# EasyEDA Pro project Prisme - Nov 2025.eprj

# Schematic Bottom Board
Board Name: Bottom Bottom; Create Date: 2025-11-04; Page Name: P1; Project Name: Prisme - Nov 2025; Schematic Name: Bottom Board; Update Date: 2025-11-09; Company: EasyEDA.com; Page Size: A4; Version: V1.0
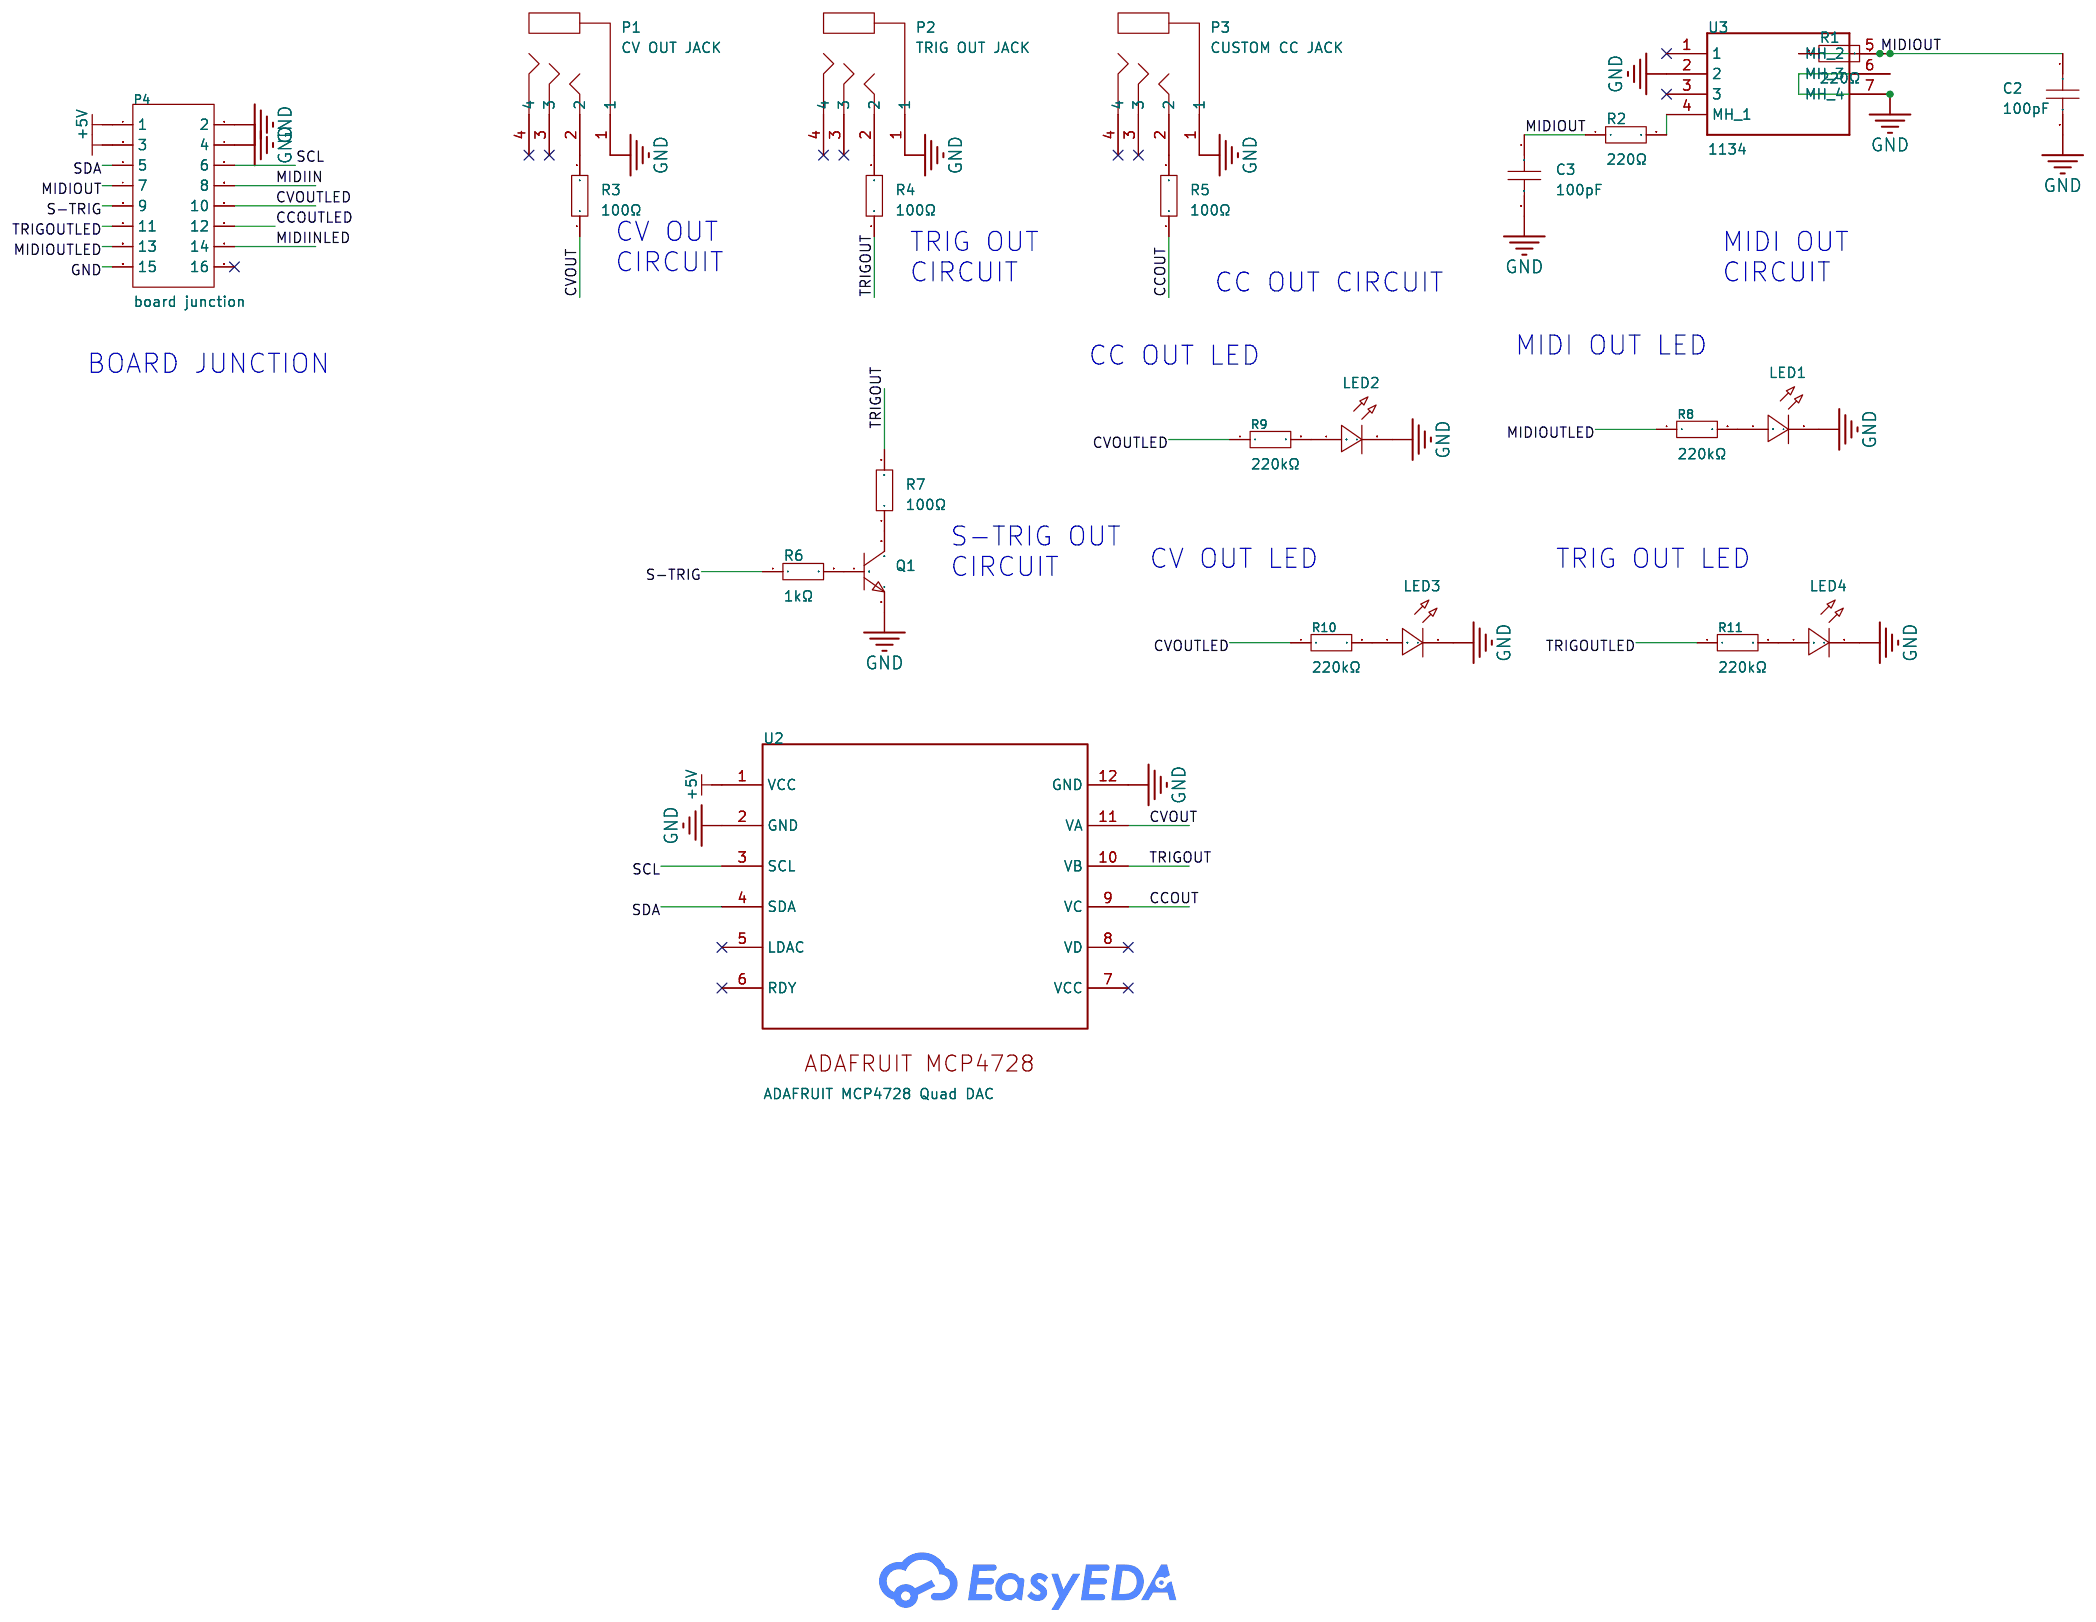
[diagram p0: schematic sheet]

## Parts
C2  100pF  [C0201]
C3  100pF  [C0201]
LED1  CVINLED  [LED-TH_BD3.0-P2.54-FD]
LED2  CVINLED  [LED-TH_BD3.0-P2.54-FD]
LED3  CVINLED  [LED-TH_BD3.0-P2.54-FD]
LED4  CVINLED  [LED-TH_BD3.0-P2.54-FD]
P1  CV OUT JACK  [AUDIO-TH_PJ-320A]
P2  TRIG OUT JACK  [AUDIO-TH_PJ-320A]
P3  CUSTOM CC JACK  [AUDIO-TH_PJ-320A]
P4  board junction  [IDC-TH_16P-P2.54_C3406]
Q1  -  [SOT-23_L2.9-W1.3-P1.90-LS2.4-BR]
R1  220Ω  [R0603]
R2  220Ω  [R0603]
R3  100Ω  [R0603]
R4  100Ω  [R0603]
R5  100Ω  [R0603]
R6  1kΩ  [R0603]
R7  100Ω  [R0603]
R8  220kΩ  [R0603]
R9  220kΩ  [R0603]
R10  220kΩ  [R0603]
R11  220kΩ  [R0603]
U2  ADAFRUIT MCP4728 Quad DAC
U3  1134  [1134]

## Library data of the parts
C2 C3 = CAP_0201: Supplier Footprint: 0201
LED1-LED4 = LED_TH-R_3mm: Supplier Footprint: Through
P1-P3 = PJ-320A: Supplier Part: C12569; Supplier Footprint: 插件; JLCPCB Part Class: Extended Part; Supplier: LCSC
P4 = 2.54-2*8P简牛: LCSC Part Name: 2.54mm 2x8P 排数:2 每排P数:8; Supplier Part: C3406; Manufacturer: BOOMELE(博穆精密); Supplier Footprint: 插件,P=2.54mm; JLCPCB Part Class: Extended Part; Datasheet: https://item.szlcsc.com/datasheet/2.54-2*8P%25E7%25AE%2580%25E7%2589%259B/3807.html; Supplier: LCSC; Connector Type: IDC Header; Pitch: 2.54mm; Number of Positions or Pins: 2x8P; Holder Type: Through Hole; Row Spacing: 2.54mm; Number of Rows: 2; Number of PINs Per Row: 8
Q1 = S8050_NPN: Supplier Footprint: SOT-23
R1-R7 = Res_0603: Supplier Footprint: 0603
R8-R11 = 0603WAF2203T5E: LCSC Part Name: 220kΩ ±1% 100mW 厚膜电阻; Supplier Part: C22961; Manufacturer: UNI-ROYAL(厚声); Supplier Footprint: 0603; JLCPCB Part Class: Basic Part; Datasheet: https://item.szlcsc.com/datasheet/0603WAF2203T5E/23688.html; Supplier: LCSC; Type: Thick Film Resistor; Tolerance: ±1%; Power(Watts): 100mW; Voltage-Supply(Max): 75V; Temperature Coefficient: ±100ppm/℃; Operating Temperature: -55℃~+155℃
U2 = ADAFRUIT MCP4728 Quad DAC: Manufacturer: ADAFRUIT; Manufacturer Part: MCP4728
U3 = 1134

## Nets
+3.3V: P4.3
+5V: P4.1 U2.1(VCC)
GND: C2.2 C3.2 LED1.2(A) LED2.2(A) LED3.2(A) LED4.2(A) P1.1 P2.1 P3.1 P4.2 P4.4 P4.15 Q1.2(E) U2.2(GND) U2.12(GND) U3.2 U3.6(MH_3) U3.7(MH_4)
CCOUT: R5.1 U2.9(VC)
CCOUTLED: P4.12
CVOUT: R3.1 U2.11(VA)
CVOUTLED: P4.10 R9.1 R10.1
MIDIIN: P4.8
MIDIINLED: P4.14
MIDIOUT: C2.1 C3.1 P4.7 R1.1 R1.2 R2.1 U3.5(MH_2)
MIDIOUTLED: P4.13 R8.1
S-TRIG: P4.9 R6.1
SCL: P4.6 U2.3(SCL)
SDA: P4.5 U2.4(SDA)
TRIGOUT: R4.1 R7.2 U2.10(VB)
TRIGOUTLED: P4.11 R11.1
Net-(LED1-1): LED1.1(C) R8.2
Net-(LED2-1): LED2.1(C) R9.2
Net-(LED3-1): LED3.1(C) R10.2
Net-(LED4-1): LED4.1(C) R11.2
Net-(P1-2): P1.2 R3.2
Net-(P2-2): P2.2 R4.2
Net-(P3-2): P3.2 R5.2
Net-(Q1-1): Q1.1(B) R6.2
Net-(Q1-3): Q1.3(C) R7.1
Net-(R2-2): R2.2 U3.4(MH_1)

Not connected (* = marked no-connect by the designer): P1 3* 4*; P2 3* 4*; P3 3* 4*; P4 16*; U2 5(LDAC)* 6(RDY)* 7(VCC)* 8(VD)*; U3 1* 3*

## Notes on the sheet
- CV OUT
  CIRCUIT
- TRIG OUT
  CIRCUIT
- MIDI OUT
  CIRCUIT
- CC OUT CIRCUIT
- MIDI OUT LED
- BOARD JUNCTION
- CC OUT LED
- CV OUT LED
- TRIG OUT LED
- S-TRIG OUT
  CIRCUIT

# Schematic Top Board
Board Name: Top Board; Create Date: 2025-11-04; Page Name: P1; Project Name: Prisme - Nov 2025; Schematic Name: Top Board; Update Date: 2025-11-04; Company: EasyEDA.com; Page Size: A4; Version: V1.0
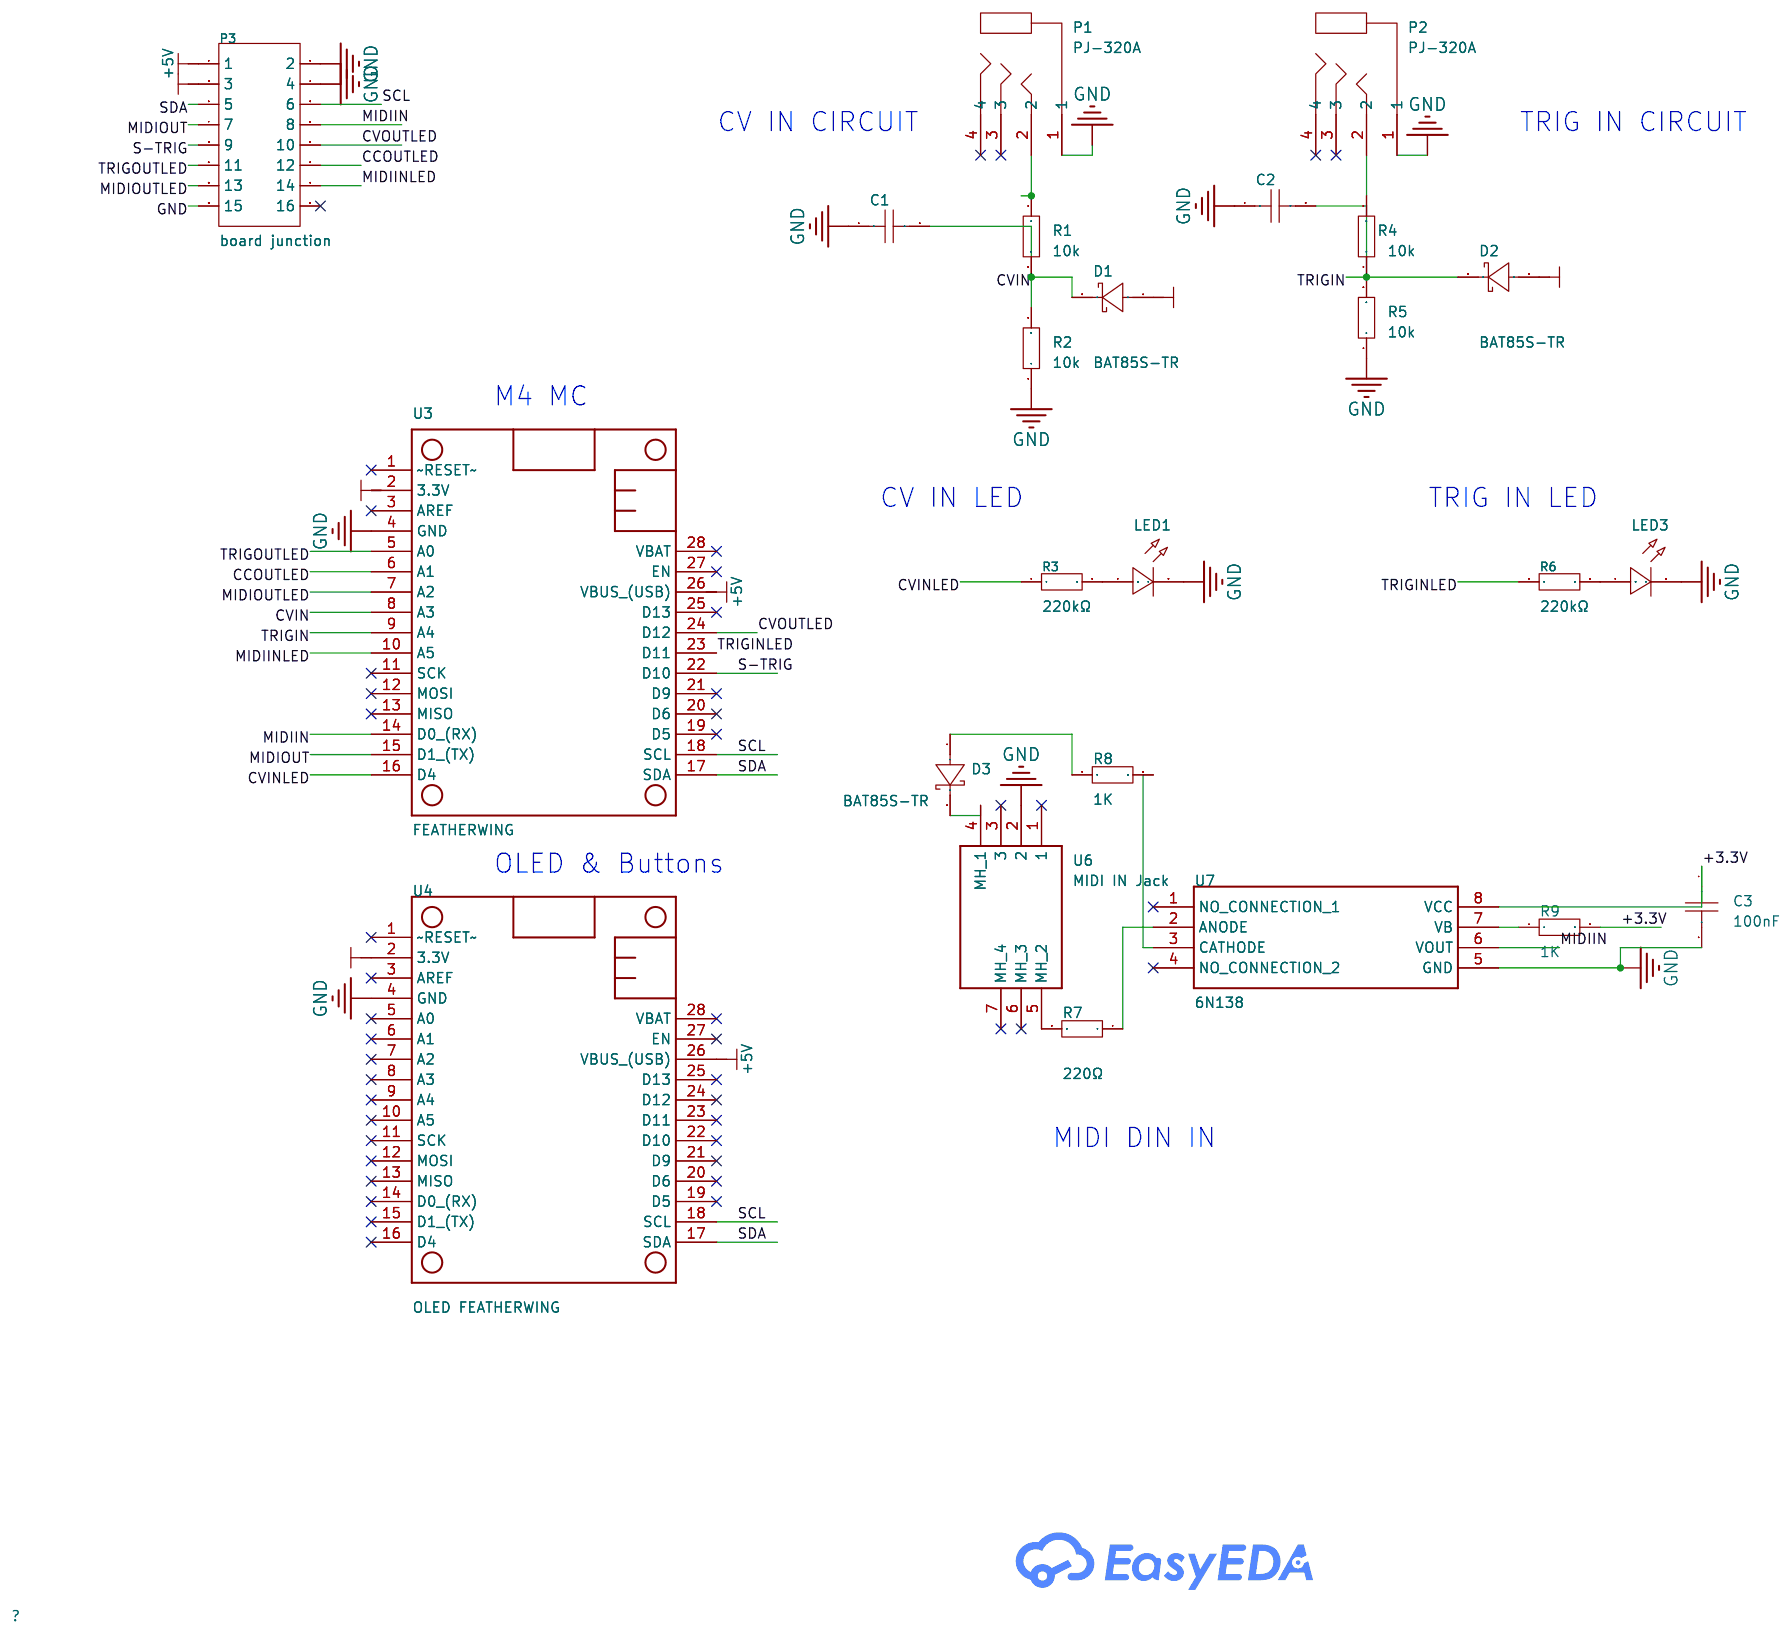
[diagram p1: schematic sheet]

## Parts
C1  100nF  [C0603]
C2  100nF  [C0603]
C3  100nF  [C0201]
D1  BAT85S-TR  [DO-35_BD1.7-L3.8-P7.8-D0.5-FD]
D2  BAT85S-TR  [DO-35_BD1.7-L3.8-P7.8-D0.5-FD]
D3  BAT85S-TR  [DO-35_BD1.7-L3.8-P7.8-D0.5-FD]
LED1  CVINLED  [LED-TH_BD3.0-P2.54-FD]
LED3  TRIGINLED  [LED-TH_BD3.0-P2.54-FD]
P1  PJ-320A  [AUDIO-TH_PJ-320A]
P2  PJ-320A  [AUDIO-TH_PJ-320A]
P3  board junction  [IDC-TH_16P-P2.54_C3406]
R1  10K  [R0603]
R2  10K  [R0603]
R3  220kΩ  [R0603]
R4  10K  [R0603]
R5  10K  [R0603]
R6  220kΩ  [R0603]
R7  220Ω  [R0603]
R8  1K  [R0603]
R9  1K  [R0603]
U3  FEATHERWING  [FEATHERWING]
U4  OLED FEATHERWING  [FEATHERWING]
U6  MIDI IN Jack  [1134]
U7  6N138  [DIP762W60P254L976H480Q8N]

## Library data of the parts
C1 C2 = CC0603KRX7R9BB104: LCSC Part Name: 100nF ±10% 50V; Supplier Part: C14663; Manufacturer: YAGEO(国巨); Supplier Footprint: 0603; JLCPCB Part Class: Basic Part; Datasheet: https://item.szlcsc.com/datasheet/CC0603KRX7R9BB104/15331.html; Supplier: LCSC; Tolerance: ±10%; Voltage Rating: 50V; Temperature Coefficient: X7R
C3 = CAP_0201: Supplier Footprint: 0201
D1-D3 = BAT85S-TR: Supplier Part: C5334431; Manufacturer: VISHAY(威世); Supplier Footprint: DO-35; JLCPCB Part Class: Extended Part; Datasheet: https://item.szlcsc.com/datasheet/BAT85S-TR/6098608.html; Supplier: LCSC; Diode Configuration: 1 Independent; Voltage - Forward(Vf@If): 800mV@100mA; Voltage - DC Reverse(Vr): 30V; Current - Rectified: 200mA; Reverse Leakage Current (Ir): 2uA@25V; Non-Repetitive Peak Forward Surge Current: 5A
LED1 LED3 = LED_TH-R_3mm: Supplier Footprint: Through
P1 P2 = PJ-320A: Supplier Part: C12569; Supplier Footprint: 插件; JLCPCB Part Class: Extended Part; Supplier: LCSC
P3 = 2.54-2*8P简牛: LCSC Part Name: 2.54mm 2x8P 排数:2 每排P数:8; Supplier Part: C3406; Manufacturer: BOOMELE(博穆精密); Supplier Footprint: 插件,P=2.54mm; JLCPCB Part Class: Extended Part; Datasheet: https://item.szlcsc.com/datasheet/2.54-2*8P%25E7%25AE%2580%25E7%2589%259B/3807.html; Supplier: LCSC; Connector Type: IDC Header; Pitch: 2.54mm; Number of Positions or Pins: 2x8P; Holder Type: Through Hole; Row Spacing: 2.54mm; Number of Rows: 2; Number of PINs Per Row: 8
R1 R2 R4 R5 R7-R9 = Res_0603: Supplier Footprint: 0603
R3 R6 = 0603WAF2203T5E: LCSC Part Name: 220kΩ ±1% 100mW 厚膜电阻; Supplier Part: C22961; Manufacturer: UNI-ROYAL(厚声); Supplier Footprint: 0603; JLCPCB Part Class: Basic Part; Datasheet: https://item.szlcsc.com/datasheet/0603WAF2203T5E/23688.html; Supplier: LCSC; Type: Thick Film Resistor; Tolerance: ±1%; Power(Watts): 100mW; Voltage-Supply(Max): 75V; Temperature Coefficient: ±100ppm/℃; Operating Temperature: -55℃~+155℃
U3 U4 = FEATHER M4
U6 = 1134
U7 = 6N138

## Nets
+3.3V: C3.1 D1.1(A) D2.1(A) P3.3 R9.2 U3.2(3.3V) U4.2(3.3V) U7.8(VCC)
+5V: P3.1 U3.26(VBUS (USB)) U4.26(VBUS (USB))
GND: C1.1 C2.1 C3.2 LED1.2(A) LED3.2(A) P1.1 P2.1 P3.2 P3.4 P3.15 R2.1 R5.1 U3.4(GND) U4.4(GND) U6.2 U7.5(GND)
CCOUTLED: P3.12 U3.6(A1)
CVIN: C1.2 D1.2(K) R1.2 R2.2 U3.8(A3)
CVINLED: R3.1 U3.16(D4)
CVOUTLED: P3.10 U3.24(D12)
MIDIIN: P3.8 U3.14(D0 (RX)) U7.6(VOUT)
MIDIINLED: P3.14 U3.10(A5)
MIDIOUT: P3.7 U3.15(D1 (TX))
MIDIOUTLED: P3.13 U3.7(A2)
S-TRIG: P3.9 U3.22(D10)
SCL: P3.6 U3.18(SCL) U4.18(SCL)
SDA: P3.5 U3.17(SDA) U4.17(SDA)
TRIGIN: C2.2 D2.2(K) R4.1 R5.2 U3.9(A4)
TRIGINLED: R6.1 U3.23(D11)
TRIGOUTLED: P3.11 U3.5(A0)
$1N996: P2.2 R4.2
$1N2746: P1.2 R1.1
Net-(D3-1): D3.1(A) R8.1
Net-(D3-2): D3.2(K) U6.4(MH_1)
Net-(LED1-1): LED1.1(C) R3.2
Net-(LED3-1): LED3.1(C) R6.2
Net-(R7-1): R7.1 U7.2(ANODE)
Net-(R7-2): R7.2 U6.5(MH_2)
Net-(R8-2): R8.2 U7.3(CATHODE)
Net-(R9-1): R9.1 U7.7(VB)

Not connected (* = marked no-connect by the designer): P1 3* 4*; P2 3* 4*; P3 16*; U3 1(~RESET~)* 3(AREF)* 11(SCK)* 12(MOSI)* 13(MISO)* 19(D5)* 20(D6)* 21(D9)* 25(D13)* 27(EN)* 28(VBAT)*; U4 1(~RESET~)* 3(AREF)* 5(A0)* 6(A1)* 7(A2)* 8(A3)* 9(A4)* 10(A5)* 11(SCK)* 12(MOSI)* 13(MISO)* 14(D0 (RX))* 15(D1 (TX))* 16(D4)* 19(D5)* 20(D6)* 21(D9)* 22(D10)* 23(D11)* 24(D12)* 25(D13)* 27(EN)* 28(VBAT)*; U6 1* 3* 6(MH_3)* 7(MH_4)*; U7 1(NO_CONNECTION)* 4(NO_CONNECTION_2)*

## Notes on the sheet
- CV IN CIRCUIT
- TRIG IN CIRCUIT
- M4 MC
- CV IN LED
- TRIG IN LED
- OLED & Buttons
- MIDI DIN IN

# Board PCB2
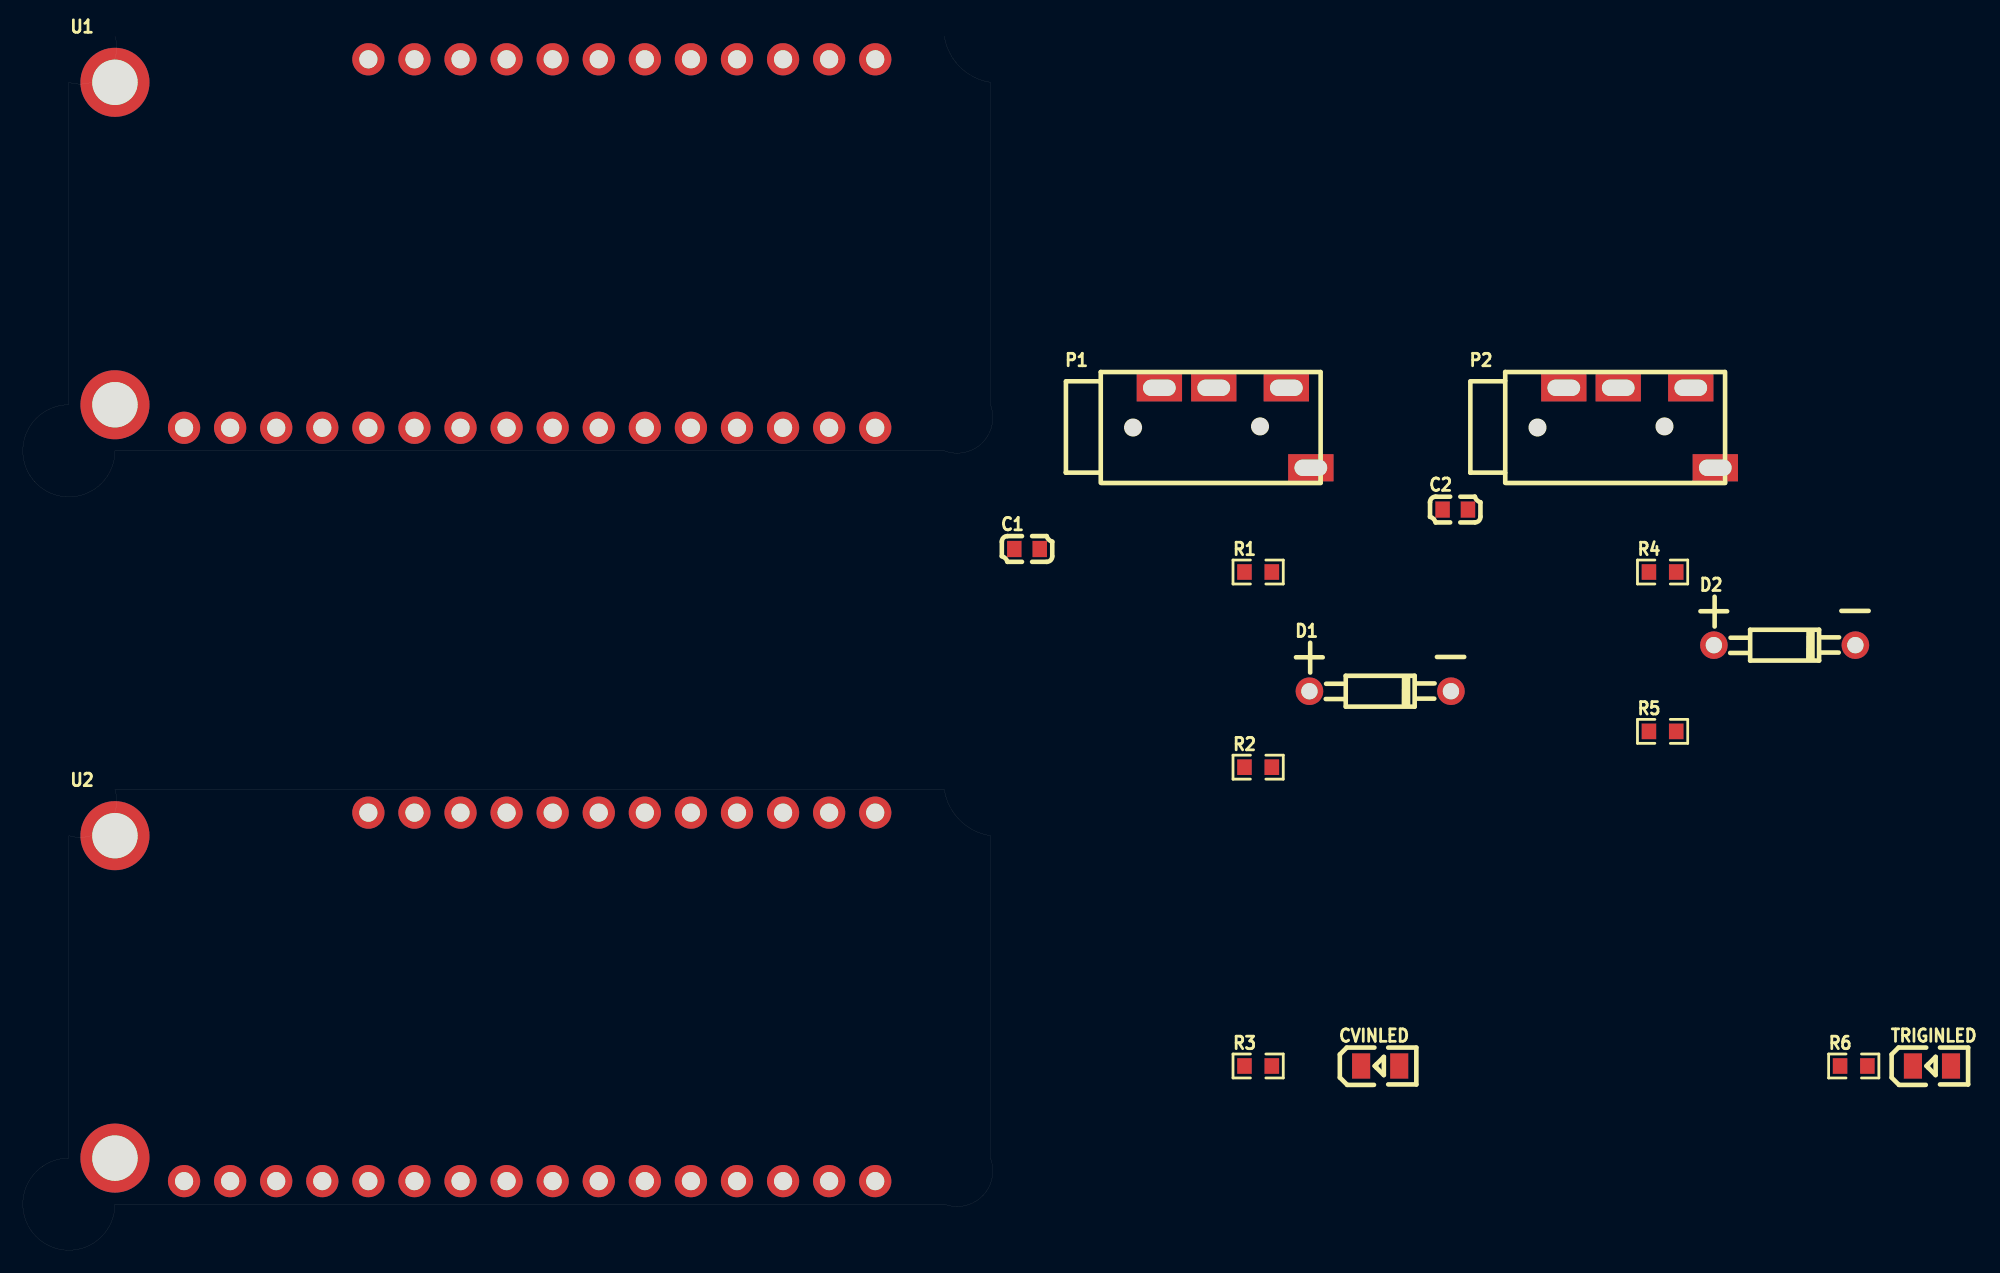
[diagram p2: board, top side]
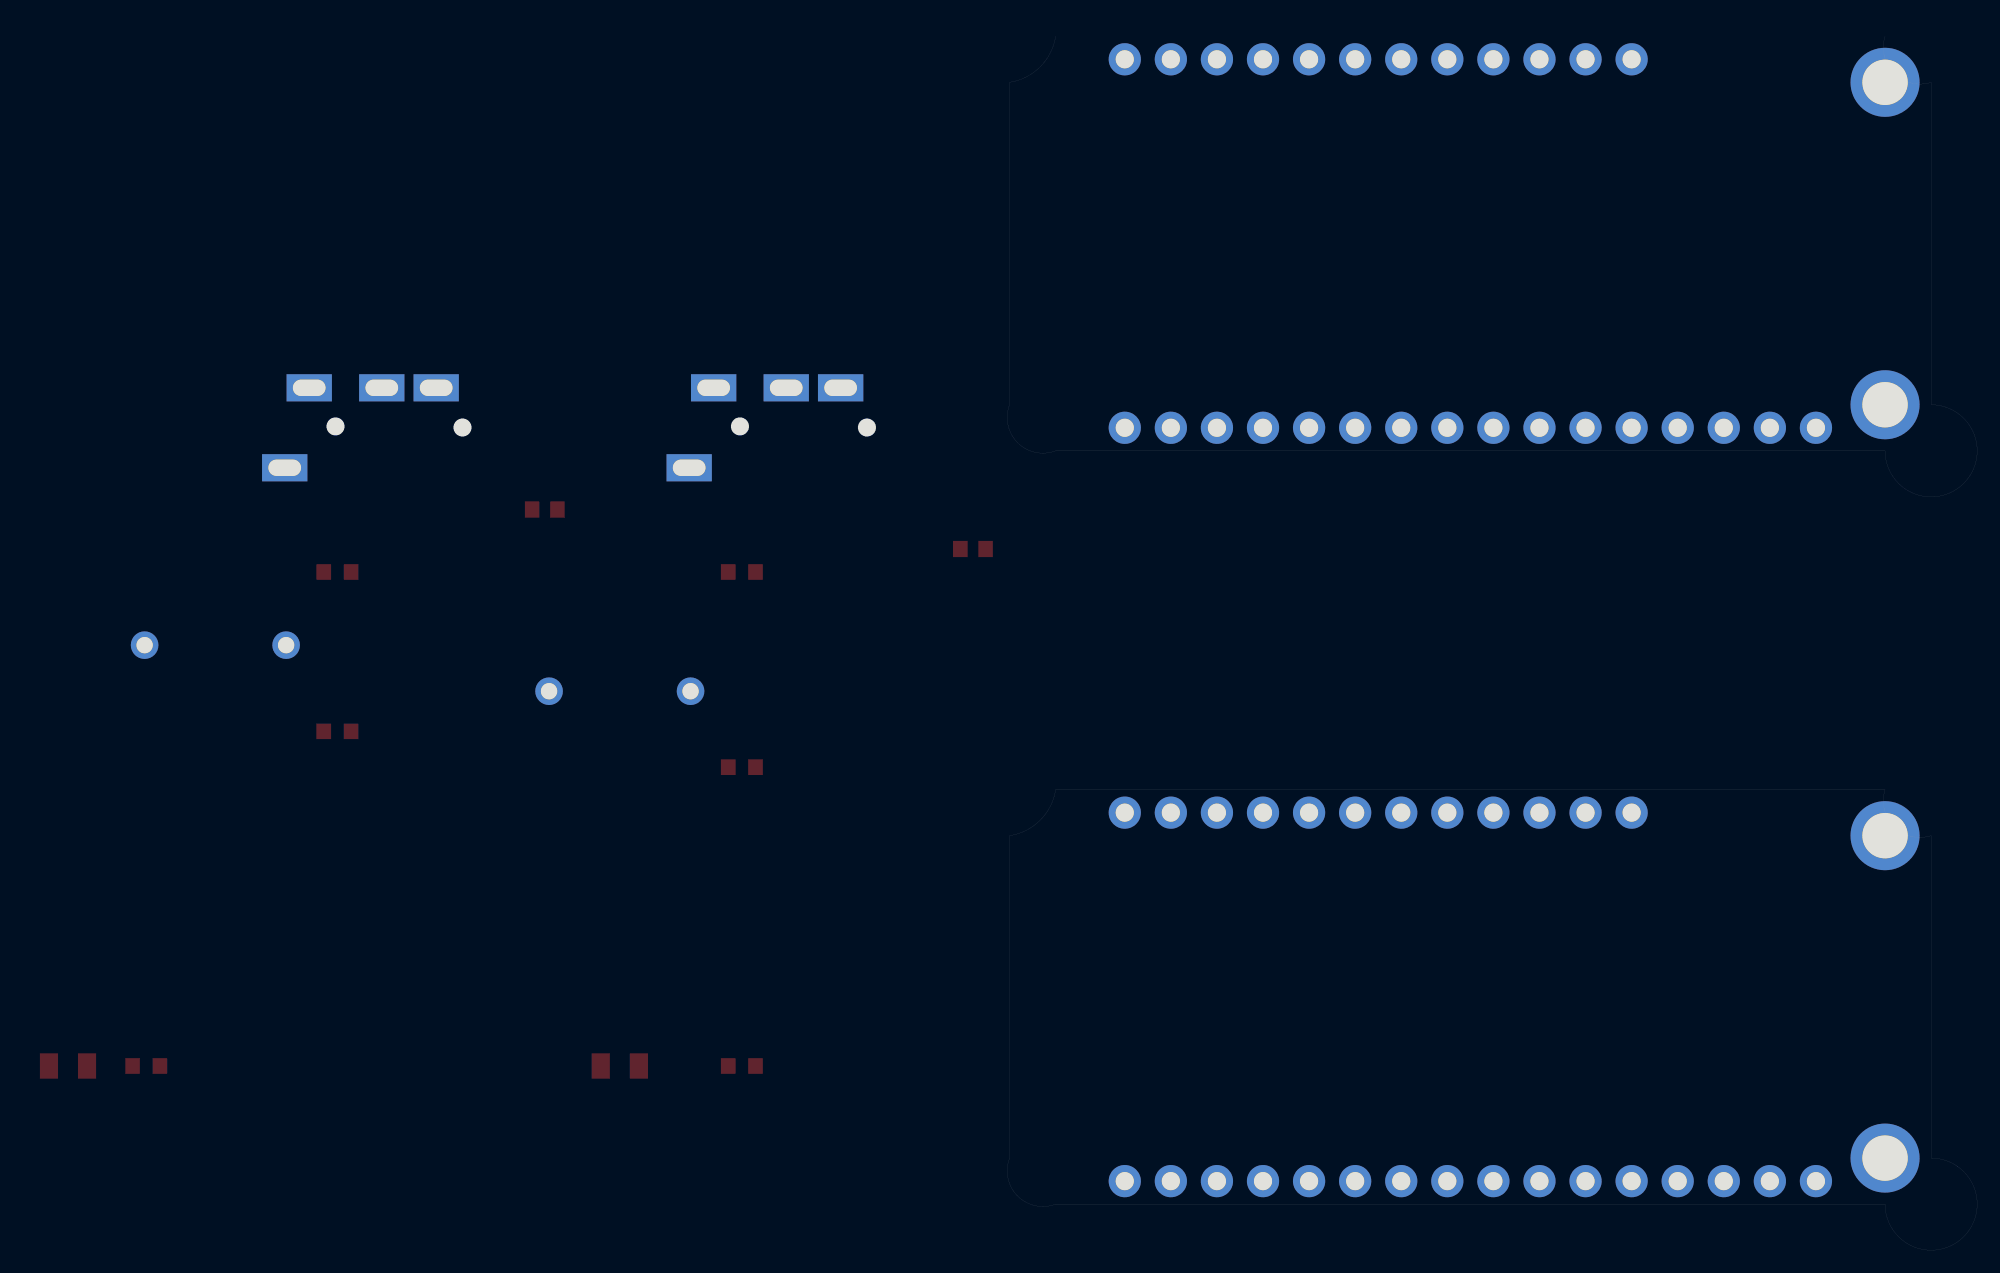
[diagram p3: board, bottom side, seen from below]

Outline 90.25 x 66.2 mm; copper layers: Top Layer, Bottom Layer. Coordinates in mm from the lower left corner of the outline.
Stack: Top Layer 0.035mm / Dielectric1 1.51mm FR4 er 4.5 / Bottom Layer 0.035mm

## Design rules (mm)
template: JLCPCB Capability(Two Layers Board)
spacing copperThickness1oz (default): track to track 0.102, other pairs 0.152 to 0.3
spacing copperThickness2oz: track to track 0.203, other pairs 0.152 to 0.3
track width copperThickness1oz (default): min 0.127, default 0.254, max 2.54
track width copperThickness2oz: min 0.203, default 0.254, max 2.54
differential pair differentialPair (default): width min 0.127, default 0.254, max 2.54; gap min 0.152, default 0.152
via viaSize (default): diameter min 0.5, default 0.61, max 10; hole min 0.3, default 0.305, max 6.3

## Placement (name value [footprint] x y rotation side)
C1  100nF  [C0603]  54.61 37.93 0 top
C2  100nF  [C0603]  78.22 40.1 0 top
CVINLED  KT-0805Y  [LED0805-R-RD]  74.08 9.42 0 top
D1  BAT85S-TR  [DO-35_BD1.7-L3.8-P7.8-D0.5-FD]  74.08 30.08 0 top
D2  BAT85S-TR  [DO-35_BD1.7-L3.8-P7.8-D0.5-FD]  96.38 32.62 0 top
P1  PJ-320A  [AUDIO-TH_PJ-320A]  66.08 44.61 0 top
P2  PJ-320A  [AUDIO-TH_PJ-320A]  88.38 44.61 0 top
R1  10K  [R0603]  67.35 36.66 0 top
R2  10K  [R0603]  67.35 25.89 0 top
R3  220kΩ  [R0603]  67.35 9.42 0 top
R4  10K  [R0603]  89.65 36.66 0 top
R5  10K  [R0603]  89.65 27.87 0 top
R6  220kΩ  [R0603]  100.19 9.42 0 top
TRIGINLED  KT-0805Y  [LED0805-R-RD]  104.5 9.42 0 top
U1  FEATHER M4  [FEATHERWING]  1.8 43.34 0 top
U2  OLED FEATHERWING  [FEATHERWING]  1.8 1.8 0 top

## Footprints (pads in the part's own frame, mm; a bottom-side part is the same pattern mirrored in y, then rotated)
AUDIO-TH_PJ-320A
  rect 2.5x1.5 hole 1.8x0.9: 1(4.175,-2.204) 2(2.825,2.204) 3(-1.175,2.204) 4(-4.175,2.204)
C0603
  rect 0.8x0.9 smd: 1(-0.7,0) 2(0.7,0)
DO-35_BD1.7-L3.8-P7.8-D0.5-FD
  round 1.524 hole 0.9: 1(3.9,0) 2(-3.9,0)
FEATHERWING
  round 3.81 hole 2.5: (2.54,20.32) (2.54,2.54)
  round 1.778 hole 1: 1(6.35,1.27) 2(8.89,1.27) 3(11.43,1.27) 4(13.97,1.27) 5(16.51,1.27) 6(19.05,1.27) 7(21.59,1.27) 8(24.13,1.27) 9(26.67,1.27) 10(29.21,1.27) 11(31.75,1.27) 12(34.29,1.27) 13(36.83,1.27) 14(39.37,1.27) 15(41.91,1.27) 16(44.45,1.27) 17(44.45,21.59) 18(41.91,21.59) 19(39.37,21.59) 20(36.83,21.59) 21(34.29,21.59) 22(31.75,21.59) 23(29.21,21.59) 24(26.67,21.59) 25(24.13,21.59) 26(21.59,21.59) 27(19.05,21.59) 28(16.51,21.59)
LED0805-R-RD
  rect 1x1.399 smd: 1(1.05,0) 2(-1.05,0)
R0603
  rect 0.806x0.864 smd: 1(-0.753,0) 2(0.753,0)

## Nets
3.3V: U1.2
+3.3V: D1.1 D2.1 U2.2
+5V: U1.26 U2.26
GND: C1.1 C2.1 CVINLED.2 P1.1 P2.1 R2.1 R5.1 TRIGINLED.2 U1.4 U2.4
CVINLEDPORT: R3.1 U1.16
CVINPORT: C1.2 D1.2 R1.2 R2.2 U1.8
FWSCLPORT: U1.18 U2.18
FWSDAPORT: U1.17 U2.17
TRIGINLEDPORT: R6.1 U1.23
TRIGINPORT: C2.2 D2.2 R4.1 R5.2 U1.9
$1N996: P2.2 R4.2
$1N1933: CVINLED.1 R3.2
$1N2746: P1.2 R1.1
$1N3175: R6.2 TRIGINLED.1

Pads without a net: P1 3 4; P2 3 4; U1 1 3 5 6 7 10 11 12 13 14 15 19 20 21 22 24 25 27 28; U2 1 3 5 6 7 8 9 10 11 12 13 14 15 16 19 20 21 22 23 24 25 27 28
